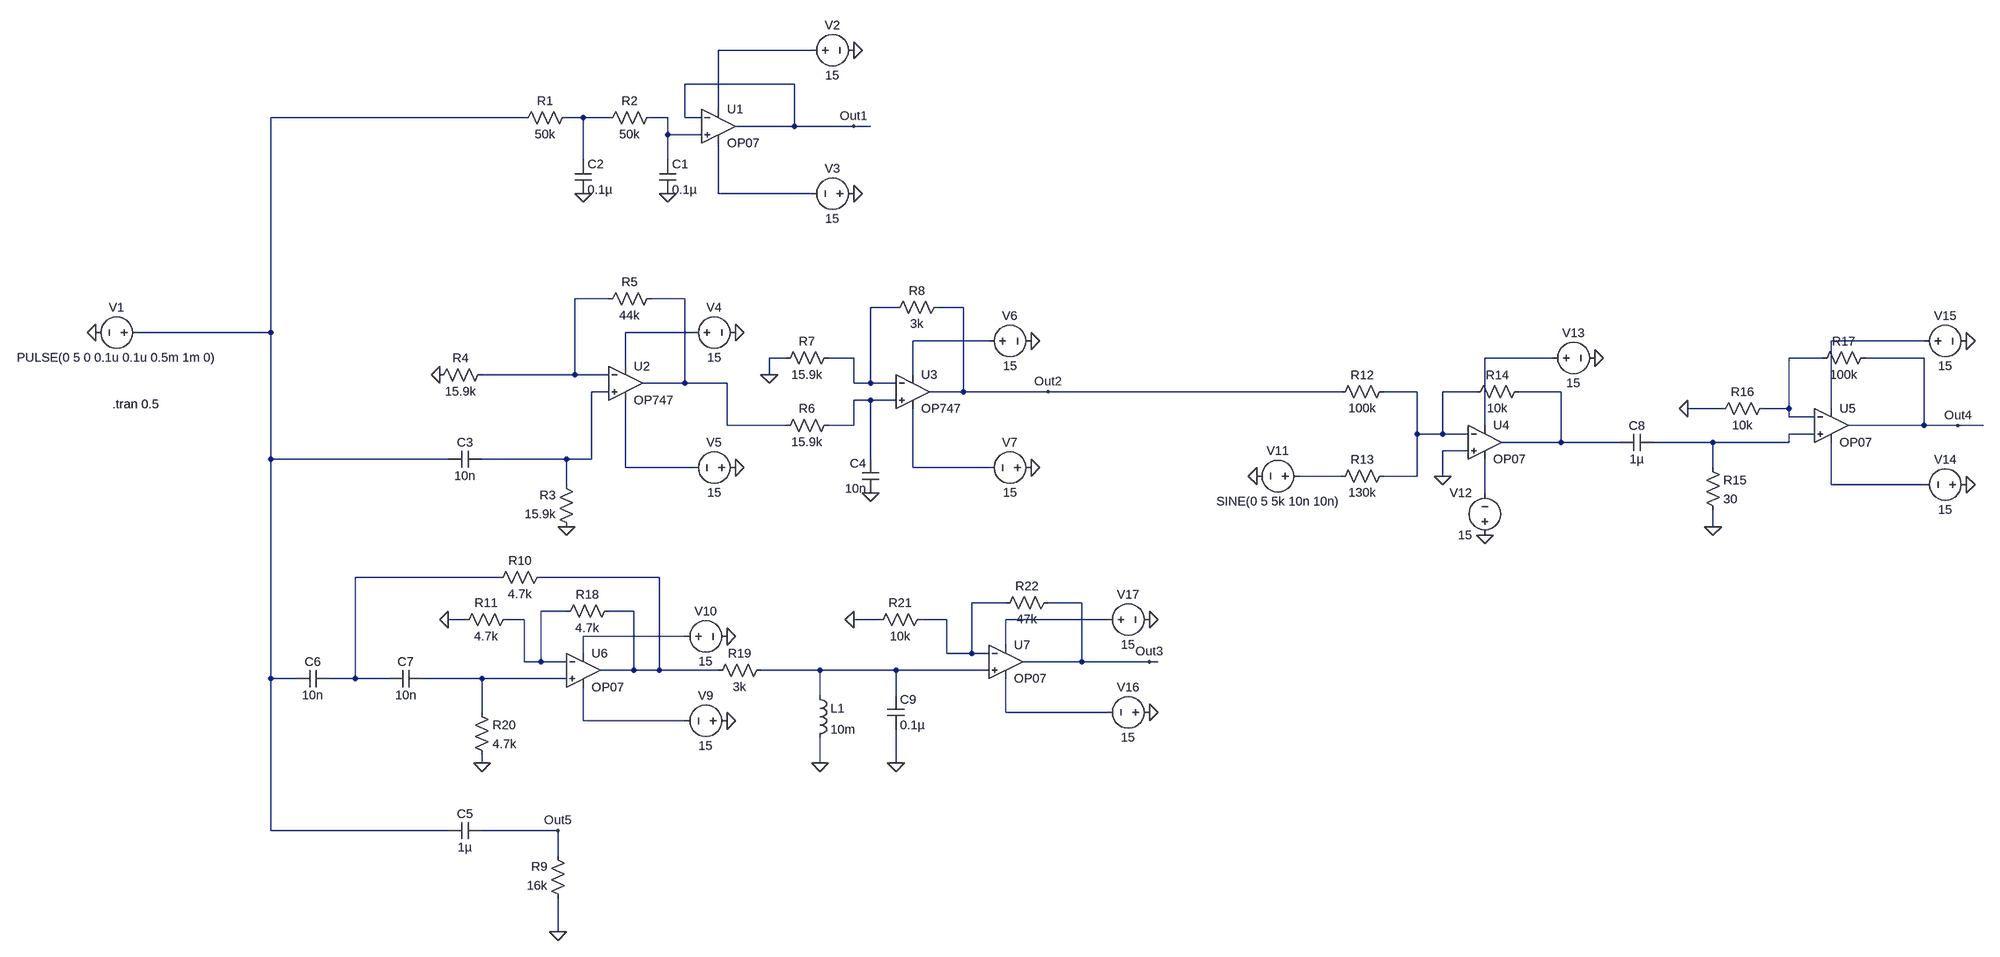
[diagram p0: schematic Project Simulation.asc]
Project Simulation.asc, the LTspice schematic file:
Version 4.1
SHEET 1 2852 1412
WIRE 592 -512 416 -512
WIRE 560 -448 352 -448
WIRE 416 -400 416 -512
WIRE 48 -384 -432 -384
WIRE 160 -384 128 -384
WIRE 208 -384 160 -384
WIRE 320 -384 288 -384
WIRE 352 -384 352 -448
WIRE 384 -384 352 -384
WIRE 560 -368 560 -448
WIRE 560 -368 448 -368
WIRE 672 -368 560 -368
WIRE 704 -368 672 -368
WIRE 320 -352 320 -384
WIRE 384 -352 320 -352
WIRE 160 -304 160 -384
WIRE 320 -304 320 -352
WIRE 416 -240 416 -336
WIRE 592 -240 416 -240
WIRE 208 16 144 16
WIRE 352 16 288 16
WIRE 752 32 704 32
WIRE 880 32 832 32
WIRE -432 80 -432 -384
WIRE -432 80 -832 80
WIRE 368 80 240 80
WIRE 928 96 784 96
WIRE 2736 96 2560 96
WIRE 544 128 512 128
WIRE 672 128 624 128
WIRE 2032 128 1904 128
WIRE 2544 128 2480 128
WIRE 2736 128 2624 128
WIRE 240 144 240 80
WIRE 144 160 144 16
WIRE 144 160 -32 160
WIRE 208 160 144 160
WIRE 512 160 512 128
WIRE 784 160 784 96
WIRE 352 176 352 16
WIRE 352 176 272 176
WIRE 432 176 352 176
WIRE 672 176 672 128
WIRE 704 176 704 32
WIRE 704 176 672 176
WIRE 752 176 704 176
WIRE 208 192 176 192
WIRE 880 192 880 32
WIRE 880 192 816 192
WIRE 1040 192 880 192
WIRE 1632 192 1040 192
WIRE 1776 192 1712 192
WIRE 1888 192 1824 192
WIRE 2048 192 1968 192
WIRE 704 208 672 208
WIRE 752 208 704 208
WIRE 2352 224 2288 224
WIRE 2480 224 2480 128
WIRE 2480 224 2432 224
WIRE 2560 224 2560 96
WIRE 2480 240 2480 224
WIRE 2528 240 2480 240
WIRE 432 256 432 176
WIRE 544 256 432 256
WIRE 672 256 672 208
WIRE 672 256 624 256
WIRE 1904 256 1904 128
WIRE 2736 256 2736 128
WIRE 2736 256 2592 256
WIRE 2800 256 2736 256
WIRE 2848 256 2800 256
WIRE 1776 272 1776 192
WIRE 1824 272 1824 192
WIRE 1824 272 1776 272
WIRE 1872 272 1824 272
WIRE 2528 272 2480 272
WIRE 2048 288 2048 192
WIRE 2048 288 1936 288
WIRE 2160 288 2048 288
WIRE 2336 288 2224 288
WIRE 2480 288 2480 272
WIRE 2480 288 2336 288
WIRE 1872 304 1824 304
WIRE -432 320 -432 80
WIRE -96 320 -432 320
WIRE 128 320 -32 320
WIRE 176 320 176 192
WIRE 176 320 128 320
WIRE 704 320 704 208
WIRE 240 336 240 208
WIRE 368 336 240 336
WIRE 784 336 784 224
WIRE 928 336 784 336
WIRE 2336 336 2336 288
WIRE 1632 352 1552 352
WIRE 1776 352 1776 272
WIRE 1776 352 1712 352
WIRE 1824 352 1824 304
WIRE 128 368 128 320
WIRE 2560 368 2560 288
WIRE 2736 368 2560 368
WIRE 1904 384 1904 320
WIRE 2336 448 2336 416
WIRE 0 544 -272 544
WIRE 304 544 80 544
WIRE 960 592 896 592
WIRE 1104 592 1040 592
WIRE 128 608 80 608
WIRE 256 608 208 608
WIRE -64 624 -96 624
WIRE 48 624 16 624
WIRE 720 624 672 624
WIRE 848 624 800 624
WIRE 1152 624 960 624
WIRE 352 656 160 656
WIRE 960 672 960 624
WIRE 160 688 160 656
WIRE 848 688 848 624
WIRE 896 688 896 592
WIRE 896 688 848 688
WIRE 928 688 896 688
WIRE 48 704 48 624
WIRE 80 704 80 608
WIRE 80 704 48 704
WIRE 128 704 80 704
WIRE 1104 704 1104 592
WIRE 1104 704 992 704
WIRE 1232 704 1104 704
WIRE 1248 704 1232 704
WIRE 256 720 256 608
WIRE 256 720 192 720
WIRE 304 720 304 544
WIRE 304 720 256 720
WIRE 416 720 304 720
WIRE 608 720 496 720
WIRE 752 720 608 720
WIRE 928 720 752 720
WIRE -432 736 -432 320
WIRE -384 736 -432 736
WIRE -272 736 -272 544
WIRE -272 736 -320 736
WIRE -208 736 -272 736
WIRE -32 736 -144 736
WIRE 128 736 -32 736
WIRE 608 768 608 720
WIRE 752 768 752 720
WIRE -32 800 -32 736
WIRE 960 800 960 736
WIRE 1152 800 960 800
WIRE 160 816 160 752
WIRE 352 816 160 816
WIRE -32 896 -32 880
WIRE 608 896 608 848
WIRE 752 896 752 832
WIRE -432 1024 -432 736
WIRE -96 1024 -432 1024
WIRE 112 1024 -32 1024
WIRE 112 1072 112 1024
WIRE 112 1216 112 1152
FLAG 320 -240 0
FLAG -912 80 0
FLAG 160 -240 0
FLAG 128 448 0
FLAG 512 160 0
FLAG 704 384 0
FLAG 1472 352 0
FLAG 1824 352 0
FLAG 1904 464 0
FLAG 2112 128 0
FLAG 2800 256 Out4
FLAG 2336 448 0
FLAG 2288 224 0
FLAG 2816 96 0
FLAG 2816 368 0
FLAG -96 624 0
FLAG 752 896 0
FLAG 608 896 0
FLAG -32 896 0
FLAG 432 656 0
FLAG 432 816 0
FLAG 672 624 0
FLAG 1232 624 0
FLAG 1232 800 0
FLAG 112 1216 0
FLAG 448 80 0
FLAG 448 336 0
FLAG 1008 96 0
FLAG 1008 336 0
FLAG -112 160 0
FLAG 672 -512 0
FLAG 672 -240 0
FLAG 672 -368 Out1
FLAG 1040 192 Out2
FLAG 1232 704 Out3
FLAG 112 1024 Out5
SYMBOL OpAmps\\OP07 416 -432 R0
SYMATTR InstName U1
SYMBOL cap 304 -304 R0
SYMATTR InstName C1
SYMATTR Value 0.1µ
SYMBOL cap 144 -304 R0
SYMATTR InstName C2
SYMATTR Value 0.1µ
SYMBOL res 144 -400 R90
WINDOW 0 0 56 VBottom 2
WINDOW 3 32 56 VTop 2
SYMATTR InstName R1
SYMATTR Value 50k
SYMBOL res 304 -400 R90
WINDOW 0 0 56 VBottom 2
WINDOW 3 32 56 VTop 2
SYMATTR InstName R2
SYMATTR Value 50k
SYMBOL voltage -816 80 R90
WINDOW 0 -32 56 VBottom 2
WINDOW 3 32 56 VTop 2
WINDOW 123 0 0 Left 0
WINDOW 39 0 0 Left 0
SYMATTR InstName V1
SYMATTR Value PULSE(0 5 0 0.1u 0.1u 0.5m 1m 0)
SYMBOL res 144 464 R180
WINDOW 0 36 76 Left 2
WINDOW 3 36 40 Left 2
SYMATTR InstName R3
SYMATTR Value 15.9k
SYMBOL cap -32 304 R90
WINDOW 0 0 32 VBottom 2
WINDOW 3 32 32 VTop 2
SYMATTR InstName C3
SYMATTR Value 10n
SYMBOL res -16 144 R90
WINDOW 0 0 56 VBottom 2
WINDOW 3 32 56 VTop 2
SYMATTR InstName R4
SYMATTR Value 15.9k
SYMBOL res 304 0 R90
WINDOW 0 0 56 VBottom 2
WINDOW 3 32 56 VTop 2
SYMATTR InstName R5
SYMATTR Value 44k
SYMBOL res 640 240 R90
WINDOW 0 0 56 VBottom 2
WINDOW 3 32 56 VTop 2
SYMATTR InstName R6
SYMATTR Value 15.9k
SYMBOL res 640 112 R90
WINDOW 0 0 56 VBottom 2
WINDOW 3 32 56 VTop 2
SYMATTR InstName R7
SYMATTR Value 15.9k
SYMBOL cap 720 384 R180
WINDOW 0 24 56 Left 2
WINDOW 3 24 8 Left 2
SYMATTR InstName C4
SYMATTR Value 10n
SYMBOL res 848 16 R90
WINDOW 0 0 56 VBottom 2
WINDOW 3 32 56 VTop 2
SYMATTR InstName R8
SYMATTR Value 3k
SYMBOL OpAmps\\OP747 240 112 R0
SYMATTR InstName U2
SYMBOL OpAmps\\OP747 784 128 R0
SYMATTR InstName U3
SYMBOL cap -32 1008 R90
WINDOW 0 0 32 VBottom 2
WINDOW 3 32 32 VTop 2
SYMATTR InstName C5
SYMATTR Value 1µ
SYMBOL res 128 1168 R180
WINDOW 0 36 76 Left 2
WINDOW 3 36 40 Left 2
SYMATTR InstName R9
SYMATTR Value 16k
SYMBOL res 1728 176 R90
WINDOW 0 0 56 VBottom 2
WINDOW 3 32 56 VTop 2
SYMATTR InstName R12
SYMATTR Value 100k
SYMBOL res 1728 336 R90
WINDOW 0 0 56 VBottom 2
WINDOW 3 32 56 VTop 2
SYMATTR InstName R13
SYMATTR Value 130k
SYMBOL res 1984 176 R90
WINDOW 0 0 56 VBottom 2
WINDOW 3 32 56 VTop 2
SYMATTR InstName R14
SYMATTR Value 10k
SYMBOL OpAmps\\OP07 1904 224 R0
SYMATTR InstName U4
SYMBOL voltage 1568 352 R90
WINDOW 0 -32 56 VBottom 2
WINDOW 3 32 56 VTop 2
WINDOW 123 0 0 Left 0
WINDOW 39 0 0 Left 0
SYMATTR InstName V11
SYMATTR Value SINE(0 5 5k 10n 10n)
SYMBOL voltage 1904 480 R180
WINDOW 0 24 96 Left 2
WINDOW 3 24 16 Left 2
WINDOW 123 0 0 Left 0
WINDOW 39 0 0 Left 0
SYMATTR InstName V12
SYMATTR Value 15
SYMBOL voltage 2016 128 R270
WINDOW 0 32 56 VTop 2
WINDOW 3 -32 56 VBottom 2
WINDOW 123 0 0 Left 0
WINDOW 39 0 0 Left 0
SYMATTR InstName V13
SYMATTR Value 15
SYMBOL cap 2224 272 R90
WINDOW 0 0 32 VBottom 2
WINDOW 3 32 32 VTop 2
SYMATTR InstName C8
SYMATTR Value 1µ
SYMBOL res 2320 320 R0
SYMATTR InstName R15
SYMATTR Value 30
SYMBOL OpAmps\\OP07 2560 192 R0
SYMATTR InstName U5
SYMBOL res 2448 208 R90
WINDOW 0 0 56 VBottom 2
WINDOW 3 32 56 VTop 2
SYMATTR InstName R16
SYMATTR Value 10k
SYMBOL res 2640 112 R90
WINDOW 0 0 56 VBottom 2
WINDOW 3 32 56 VTop 2
SYMATTR InstName R17
SYMATTR Value 100k
SYMBOL voltage 2832 368 R90
WINDOW 0 -32 56 VBottom 2
WINDOW 3 32 56 VTop 2
WINDOW 123 0 0 Left 0
WINDOW 39 0 0 Left 0
SYMATTR InstName V14
SYMATTR Value 15
SYMBOL voltage 2720 96 R270
WINDOW 0 32 56 VTop 2
WINDOW 3 -32 56 VBottom 2
WINDOW 123 0 0 Left 0
WINDOW 39 0 0 Left 0
SYMATTR InstName V15
SYMATTR Value 15
SYMBOL cap -320 720 R90
WINDOW 0 0 32 VBottom 2
WINDOW 3 32 32 VTop 2
SYMATTR InstName C6
SYMATTR Value 10n
SYMBOL cap -144 720 R90
WINDOW 0 0 32 VBottom 2
WINDOW 3 32 32 VTop 2
SYMATTR InstName C7
SYMATTR Value 10n
SYMBOL res 96 528 R90
WINDOW 0 0 56 VBottom 2
WINDOW 3 32 56 VTop 2
SYMATTR InstName R10
SYMATTR Value 4.7k
SYMBOL OpAmps\\OP07 160 656 R0
SYMATTR InstName U6
SYMBOL res 32 608 R90
WINDOW 0 0 56 VBottom 2
WINDOW 3 32 56 VTop 2
SYMATTR InstName R11
SYMATTR Value 4.7k
SYMBOL res 224 592 R90
WINDOW 0 0 56 VBottom 2
WINDOW 3 32 56 VTop 2
SYMATTR InstName R18
SYMATTR Value 4.7k
SYMBOL res 512 704 R90
WINDOW 0 0 56 VBottom 2
WINDOW 3 32 56 VTop 2
SYMATTR InstName R19
SYMATTR Value 3k
SYMBOL ind 592 752 R0
SYMATTR InstName L1
SYMATTR Value 10m
SYMBOL cap 736 768 R0
SYMATTR InstName C9
SYMATTR Value 0.1µ
SYMBOL res -48 784 R0
SYMATTR InstName R20
SYMATTR Value 4.7k
SYMBOL voltage 448 816 R90
WINDOW 0 -32 56 VBottom 2
WINDOW 3 32 56 VTop 2
WINDOW 123 0 0 Left 0
WINDOW 39 0 0 Left 0
SYMATTR InstName V9
SYMATTR Value 15
SYMBOL voltage 336 656 R270
WINDOW 0 32 56 VTop 2
WINDOW 3 -32 56 VBottom 2
WINDOW 123 0 0 Left 0
WINDOW 39 0 0 Left 0
SYMATTR InstName V10
SYMATTR Value 15
SYMBOL OpAmps\\OP07 960 640 R0
SYMATTR InstName U7
SYMBOL res 816 608 R90
WINDOW 0 0 56 VBottom 2
WINDOW 3 32 56 VTop 2
SYMATTR InstName R21
SYMATTR Value 10k
SYMBOL res 1056 576 R90
WINDOW 0 0 56 VBottom 2
WINDOW 3 32 56 VTop 2
SYMATTR InstName R22
SYMATTR Value 47k
SYMBOL voltage 1248 800 R90
WINDOW 0 -32 56 VBottom 2
WINDOW 3 32 56 VTop 2
WINDOW 123 0 0 Left 0
WINDOW 39 0 0 Left 0
SYMATTR InstName V16
SYMATTR Value 15
SYMBOL voltage 1136 624 R270
WINDOW 0 32 56 VTop 2
WINDOW 3 -32 56 VBottom 2
WINDOW 123 0 0 Left 0
WINDOW 39 0 0 Left 0
SYMATTR InstName V17
SYMATTR Value 15
SYMBOL voltage 352 80 R270
WINDOW 0 32 56 VTop 2
WINDOW 3 -32 56 VBottom 2
WINDOW 123 0 0 Left 0
WINDOW 39 0 0 Left 0
SYMATTR InstName V4
SYMATTR Value 15
SYMBOL voltage 464 336 R90
WINDOW 0 -32 56 VBottom 2
WINDOW 3 32 56 VTop 2
WINDOW 123 0 0 Left 0
WINDOW 39 0 0 Left 0
SYMATTR InstName V5
SYMATTR Value 15
SYMBOL voltage 912 96 R270
WINDOW 0 32 56 VTop 2
WINDOW 3 -32 56 VBottom 2
WINDOW 123 0 0 Left 0
WINDOW 39 0 0 Left 0
SYMATTR InstName V6
SYMATTR Value 15
SYMBOL voltage 1024 336 R90
WINDOW 0 -32 56 VBottom 2
WINDOW 3 32 56 VTop 2
WINDOW 123 0 0 Left 0
WINDOW 39 0 0 Left 0
SYMATTR InstName V7
SYMATTR Value 15
SYMBOL voltage 576 -512 R270
WINDOW 0 32 56 VTop 2
WINDOW 3 -32 56 VBottom 2
WINDOW 123 0 0 Left 0
WINDOW 39 0 0 Left 0
SYMATTR InstName V2
SYMATTR Value 15
SYMBOL voltage 688 -240 R90
WINDOW 0 -32 56 VBottom 2
WINDOW 3 32 56 VTop 2
WINDOW 123 0 0 Left 0
WINDOW 39 0 0 Left 0
SYMATTR InstName V3
SYMATTR Value 15
TEXT -880 216 Left 2 !.tran 0.5

The netlist it stands for:
* Project Simulation.asc
X§U1 N004 Out1 N001 N005 Out1 LT1001  ; OP07, pins In+ In- V+ V- OUT
C1 N004 0 0.1µ
C2 N003 0 0.1µ
R1 N003 N002 50k
R2 N004 N003 50k
V1 N002 0 PULSE(0 5 0 0.1u 0.1u 0.5m 1m 0)
R3 0 N014 15.9k
C3 N014 N002 10n
R4 N006 0 15.9k
R5 N007 N006 44k
R6 N017 N007 15.9k
R7 N008 0 15.9k
C4 0 N017 10n
R8 Out2 N008 3k
X§U2 N014 N006 N009 N019 N007 OP747  ; pins In+ In- V+ V- OUT
X§U3 N017 N008 N010 N020 Out2 OP747  ; pins In+ In- V+ V- OUT
C5 Out5 N002 1µ
R9 0 Out5 16k
R12 N015 Out2 100k
R13 N015 N021 130k
R14 N016 N015 10k
X§U4 0 N015 N012 N023 N016 LT1001  ; OP07, pins In+ In- V+ V- OUT
V11 N021 0 SINE(0 5 5k 10n 10n)
V12 0 N023 15
V13 N012 0 15
C8 N018 N016 1µ
R15 N018 0 30
X§U5 N018 N013 N011 N022 Out4 LT1001  ; OP07, pins In+ In- V+ V- OUT
R16 N013 0 10k
R17 Out4 N013 100k
V14 0 N022 15
V15 N011 0 15
C6 N024 N002 10n
C7 N031 N024 10n
R10 N025 N024 4.7k
X§U6 N031 N027 N029 N033 N025 LT1001  ; OP07, pins In+ In- V+ V- OUT
R11 N027 0 4.7k
R18 N025 N027 4.7k
R19 N030 N025 3k
L1 N030 0 10m
C9 N030 0 0.1µ
R20 N031 0 4.7k
V9 0 N033 15
V10 N029 0 15
X§U7 N030 N026 N028 N032 Out3 LT1001  ; OP07, pins In+ In- V+ V- OUT
R21 N026 0 10k
R22 Out3 N026 47k
V16 0 N032 15
V17 N028 0 15
V4 N009 0 15
V5 0 N019 15
V6 N010 0 15
V7 0 N020 15
V2 N001 0 15
V3 0 N005 15
.tran 0.5
.lib LTC.lib
.backanno
.end